# Altium schematic sheet MP2307.SchDoc
size 420 x 297 mm; Author: Denizhan ALTAY; SheetNumber: 2; SheetTotal: 4
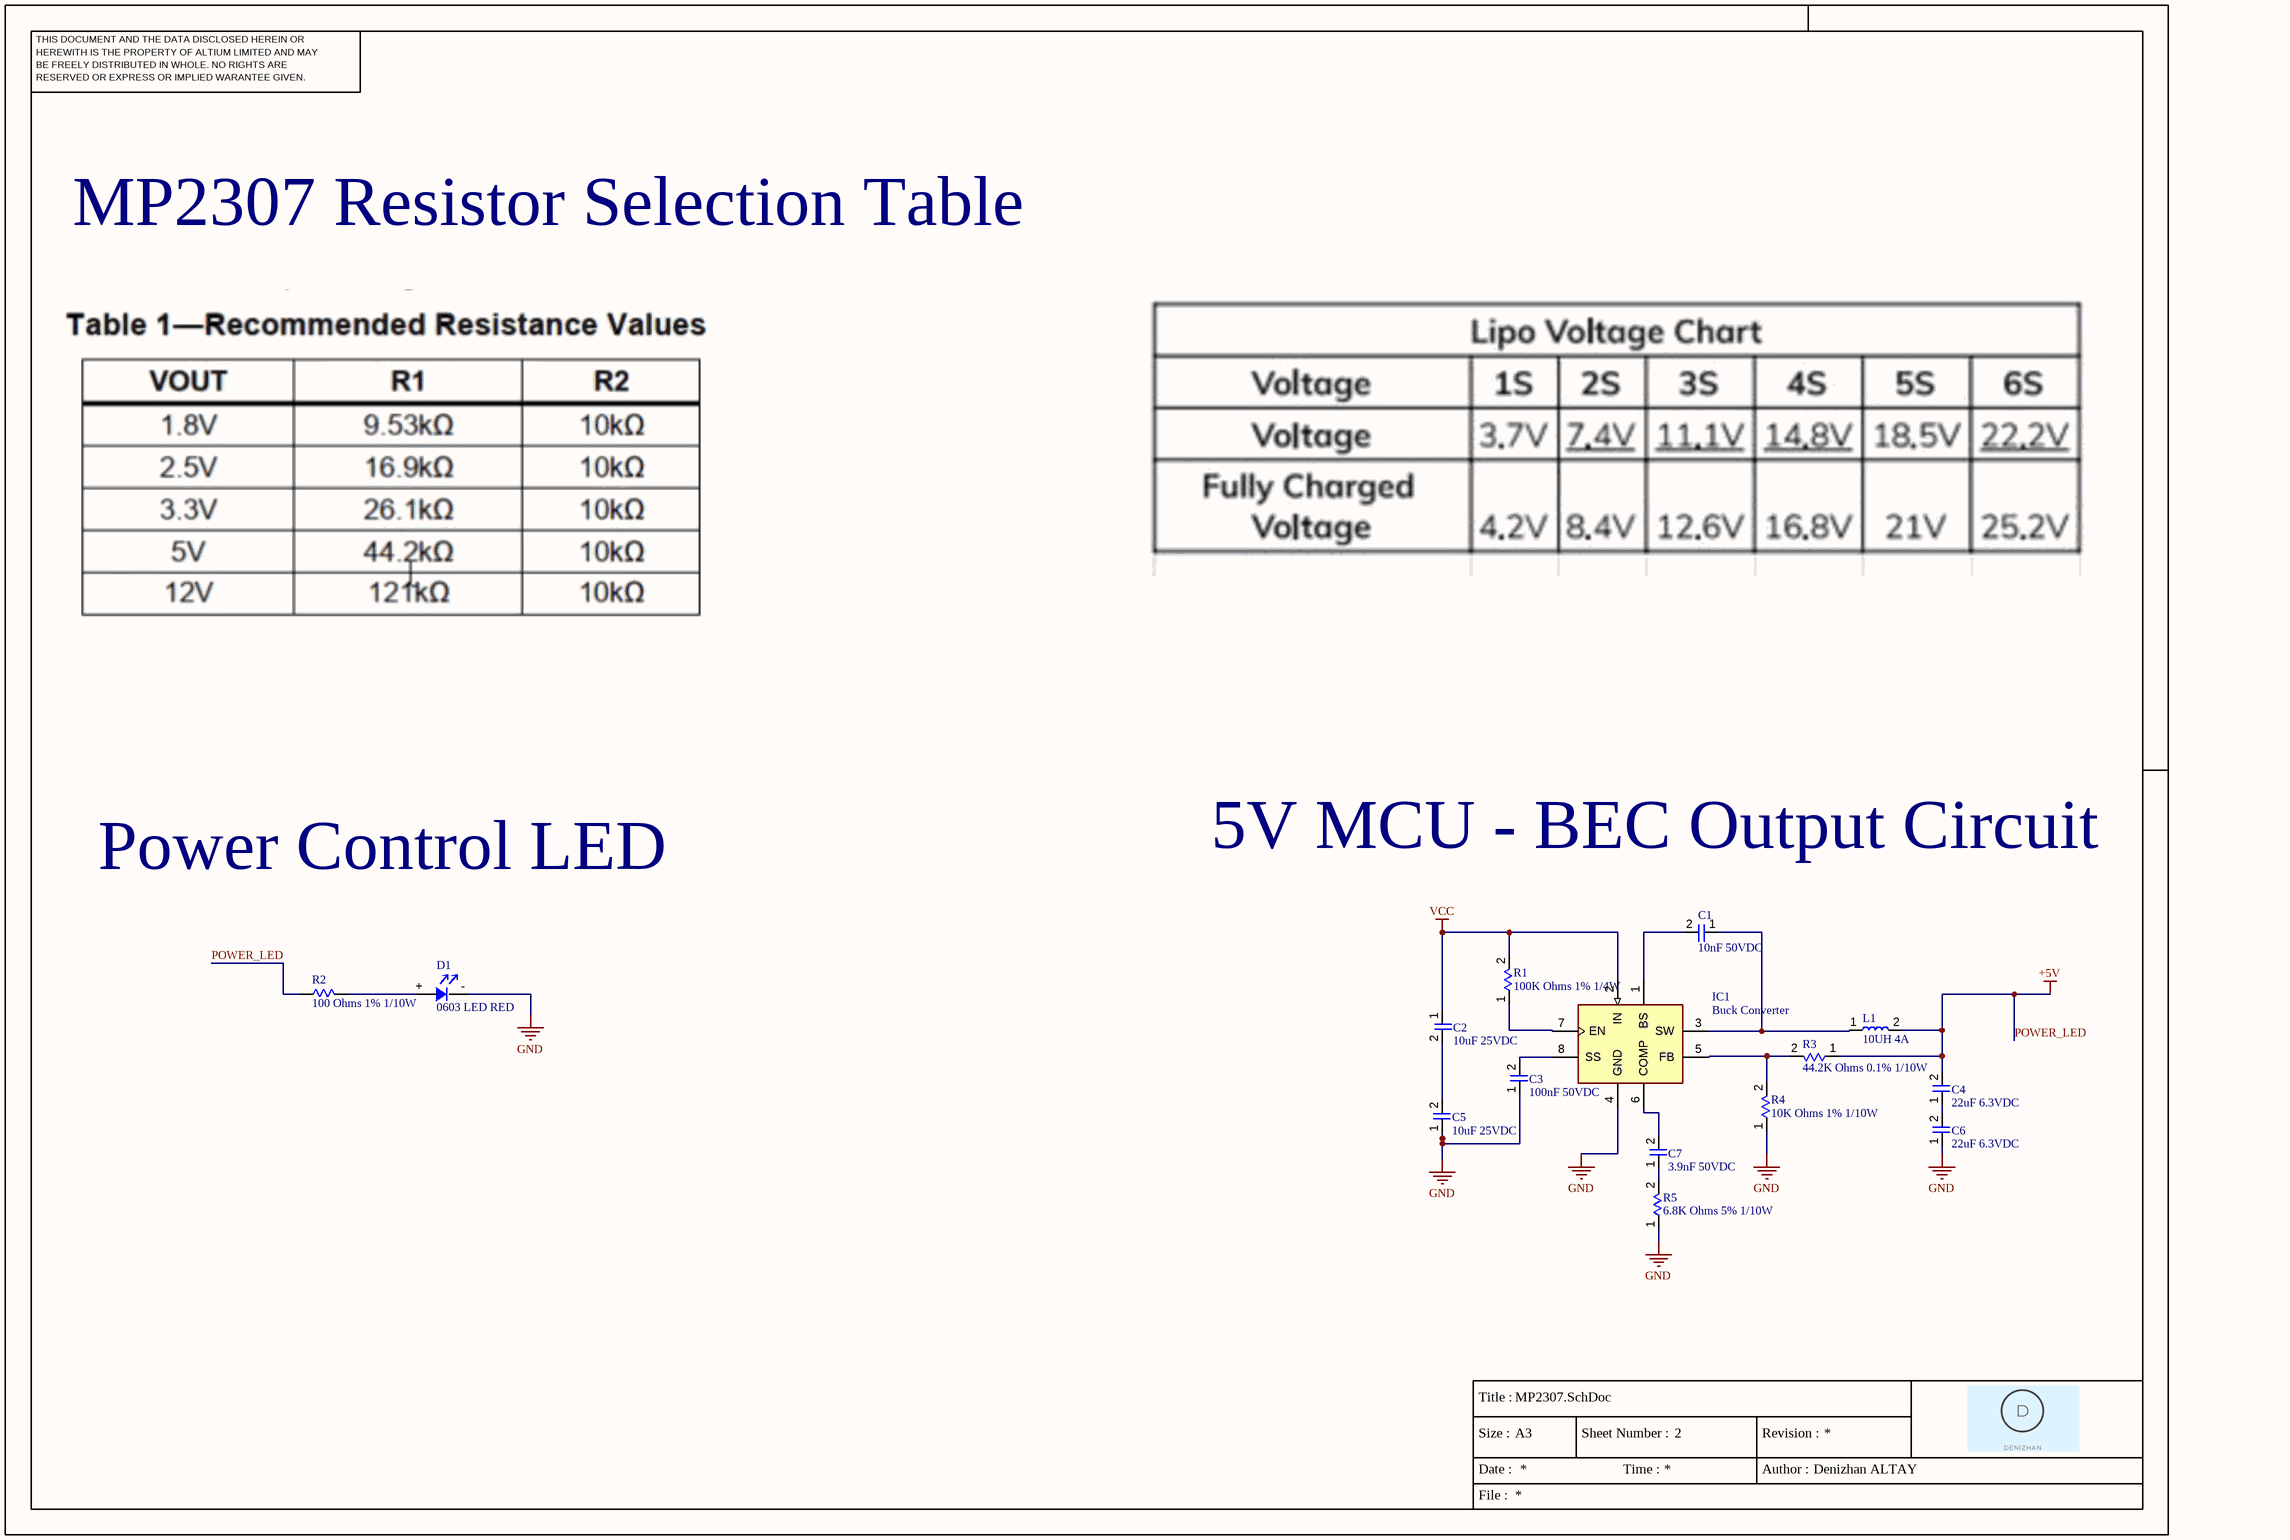
[diagram p0: MP2307.SchDoc]

## Parts
C1  10nF 50VDC  [0603_UnP_Capacitor]
C2  10uF 25VDC  [0603_UnP_Capacitor]
C3  100nF 50VDC  [0603_UnP_Capacitor]
C4  22uF 6.3VDC  [0603_UnP_Capacitor]
C5  10uF 25VDC  [0603_UnP_Capacitor]
C6  22uF 6.3VDC  [0603_UnP_Capacitor]
C7  3.9nF 50VDC  [0603_UnP_Capacitor]
D1  0603 LED RED  [LED Diode 0603]
IC1  Buck Converter  [MP2307_SOIC127P600X170_HS-9N]
L1  10UH 4A  [IHLP-2525CZ-11_Inductor]
R1  100K Ohms 1% 1/4W  [0603_Resistor_Case]
R2  100 Ohms 1% 1/10W  [0603_Resistor_Case]
R3  44.2K Ohms 0.1% 1/10W  [0603_Resistor_Case]
R4  10K Ohms 1% 1/10W  [0603_Resistor_Case]
R5  6.8K Ohms 5% 1/10W  [0603_Resistor_Case]

## Nets
GND: C3.1 C5.1 C6.1 D1.- IC1.4(GND) R4.1 R5.1
POWER_LED: C4.2 L1.2 R2.1 R3.1  [also labelled +5V]
VCC: C2.1 IC1.2(IN) R1.2
NetC1_1: C1.1 IC1.3(SW) L1.1
NetC1_2: C1.2 IC1.1(BS)
NetC2_2: C2.2 C5.2
NetC3_2: C3.2 IC1.8(SS)
NetC4_1: C4.1 C6.2
NetC7_1: C7.1 R5.2
NetC7_2: C7.2 IC1.6(COMP)
NetD1_+: D1.+ R2.2
NetIC1_5: IC1.5(FB) R3.2 R4.2
NetIC1_7: IC1.7(EN) R1.1

## Notes on the sheet
- MP2307 Resistor Selection Table
- Power Control LED
- 5V MCU - BEC Output Circuit
- THIS DOCUMENT AND THE DATA DISCLOSED HEREIN OR
- HEREWITH IS THE PROPERTY OF ALTIUM LIMITED AND MAY
- BE FREELY DISTRIBUTED IN WHOLE. NO RIGHTS ARE
- RESERVED OR EXPRESS OR IMPLIED WARANTEE GIVEN.
- Title :
- Size :
- Date :
- A3
- Sheet Number :
- Time :
- Revision :
- Author :
- File :

## Library data of the parts
C1 = CL10B103KB8NNNC - MLCC (1608) 0603 10nF 50VDC ±10% X7R: Manufacturer: SAMSUNG; Capacitor Type: Unpolarized; Max Working Voltage: 50V; Library Ref: Capacitors; Package / Case: 0603; Capacitor Value: 10nF; Part Number: CL10B103KB8NNNC; ComponentLink1Description: New link; ComponentLink1URL: https://www.ozdisan.com/passive-components/resistors/smt-smd-and-chip-resistors/PS03W4F1003T5E/592727
C2 C5 = MCF03MTX250106 - MLCC 0603 10uF 25VDC ±20% X5R: MCF03MTX250106 - MLCC (1608) 0603 10uF 25VDC ±20% X5R; Manufacturer: VIKING; Capacitor Type: Ceramic; Library Ref: Capacitors; Package / Case: 0603; Capacitor Value: 10uF; Part Number: MCF03MTX250106; ComponentLink1Description: New link; ComponentLink1URL: https://www.ozdisan.com/passive-components/resistors/smt-smd-and-chip-resistors/PS03W4F1003T5E/592727; Max Working Voltage: 25VDC
C3 = MCF03KTB500104 - MLCC 0603 100nF 50VDC ±10% X7R: MCF03KTB500104 - MLCC (1608) 0603 100nF 50VDC ±10% X7R; Manufacturer: VIKING; Part Number: MCF03MTX250106; Capacitor Type: Ceramic; Library Ref: Capacitors; Package / Case: 0603; Capacitor Value: 100nF; ComponentLink1Description: New link; ComponentLink1URL: https://www.ozdisan.com/passive-components/resistors/smt-smd-and-chip-resistors/PS03W4F1003T5E/592727; Max Working Voltage: 50VDC
C4 C6 = CL10A226MQ8NRNC - MLCC (1608) 0603 22uF 6.3VDC ±20% X5R: Manufacturer: SAMSUNG; Part Number: CL10B103KB8NNNC; Capacitor Type: Unpolarized; Max Working Voltage: 6.3V; Library Ref: Capacitors; Package / Case: 0603; Capacitor Value: 22uF; ComponentLink1Description: New link; ComponentLink1URL: https://www.ozdisan.com/passive-components/capacitors/smt-smd-and-mlcc-capacitors/CL10B392KB8NNNC/26336
C7 = CL10B392KB8NNNC - MLCC (1608) 0603 3.9nF 50VDC ±10% X7R: Manufacturer: SAMSUNG; Part Number: CL10B103KB8NNNC; Capacitor Type: Unpolarized; Max Working Voltage: 50V; Library Ref: Capacitors; Package / Case: 0603; Capacitor Value: 3.9nF; ComponentLink1Description: New link; ComponentLink1URL: https://www.ozdisan.com/passive-components/capacitors/smt-smd-and-mlcc-capacitors/CL10B392KB8NNNC/26336
D1 = 0603 LED RED: Type: SMD; Library Ref: LED; Package / Case: 0603; Color: Red
IC1 = MP2307: 3A and 4.75V-23V voltage regulator.; Library Ref: Voltage Regulators; Converter Type: Buck; Package / Case: SMD
L1 = IHLP2525CZER100M11 - INDUCTOR FIXED 10UH 4A 71.2MOHM SMD: Inductance Value: 10 µH; Working Voltage (Max): 50V; Inductor Type: Iron Core; Library Ref: Inductors; Package / Case: THT; Rated Current (Max): 4A
R1 = PS03W4F1003T5E - 0603 100K Ohms 1% 1/4W AUTOMOTIV: RES.(1608) 0603 100K Ohms 1% 1/4W AUTOMOTIV PS03W4F1003T5E; Manufacturer: ROYALOHM; Max Working Voltage: 50V; Library Ref: Resistors; Package / Case: 0603; Power (Watts): 1/4W; Resistor Value: 100K Ohms; Part Number: PS03W4F1003T5E; ComponentLink1Description: New link; ComponentLink1URL: https://www.ozdisan.com/passive-components/resistors/smt-smd-and-chip-resistors/PS03W4F1003T5E/592727
R2 = CQ03SAF1000T5E - 0603 100 Ohms 1% 1/10W AUTOMOTIV: Manufacturer: ROYALOHM; Working Voltage (Max): 75V; Library Ref: Resistors; Package / Case: 0603; Power (Watts): 1/10W; Resistor Value: 100 Ohms; Part Number: CQ03SAF1000T5E; ComponentLink1Description: New link; ComponentLink1URL: https://www.ozdisan.com/passive-components/resistors/smt-smd-and-chip-resistors/PS03W4F1003T5E/592727
R3 = TC0325B4422T5F - 0603 44.2K Ohms 0.1% 1/10W 25PPM: TC0325B4422T5F - RES.(1608) 0603 44.2K Ohms 0.1% 1/10W 25PPM; Manufacturer: ROYALOHM; Part Number: RI0603L104JT; Max Working Voltage: 50V; Library Ref: Resistors; Package / Case: 0603; Power (Watts): 1/10W; Resistor Value: 44.2K Ohms; ComponentLink1Description: New link; ComponentLink1URL: https://www.ozdisan.com/passive-components/resistors/smt-smd-and-chip-resistors/PS03W4F1003T5E/592727
R4 = RC0603FR-0710KL - 0603 10K Ohms 1% 1/10W 100PPM: Manufacturer: HOTTECH; Part Number: PS03W4F1003T5E; Max Working Voltage: 75V; Library Ref: Resistors; Package / Case: 0603; Power (Watts): 1/10W; Resistor Value: 10K Ohms; ComponentLink1Description: New link; ComponentLink1URL: https://www.ozdisan.com/passive-components/resistors/smt-smd-and-chip-resistors/PS03W4F1003T5E/592727
R5 = RC0603JR-076K8L - 0603 6.8K Ohms 5% 1/10W 100PPM: Manufacturer: YAGEO; Max Working Voltage: 75V; Library Ref: Resistors; Package / Case: 0603; Power (Watts): 1/10W; Resistor Value: 6.8K Ohms; Part Number: RC0603JR-076K8L; ComponentLink1Description: New link; ComponentLink1URL: https://www.ozdisan.com/passive-components/resistors/smt-smd-and-chip-resistors/PS03W4F1003T5E/592727